# EAGLE schematic baseboard4 (EAGLE 4.15)

## Sheet 1 of 3
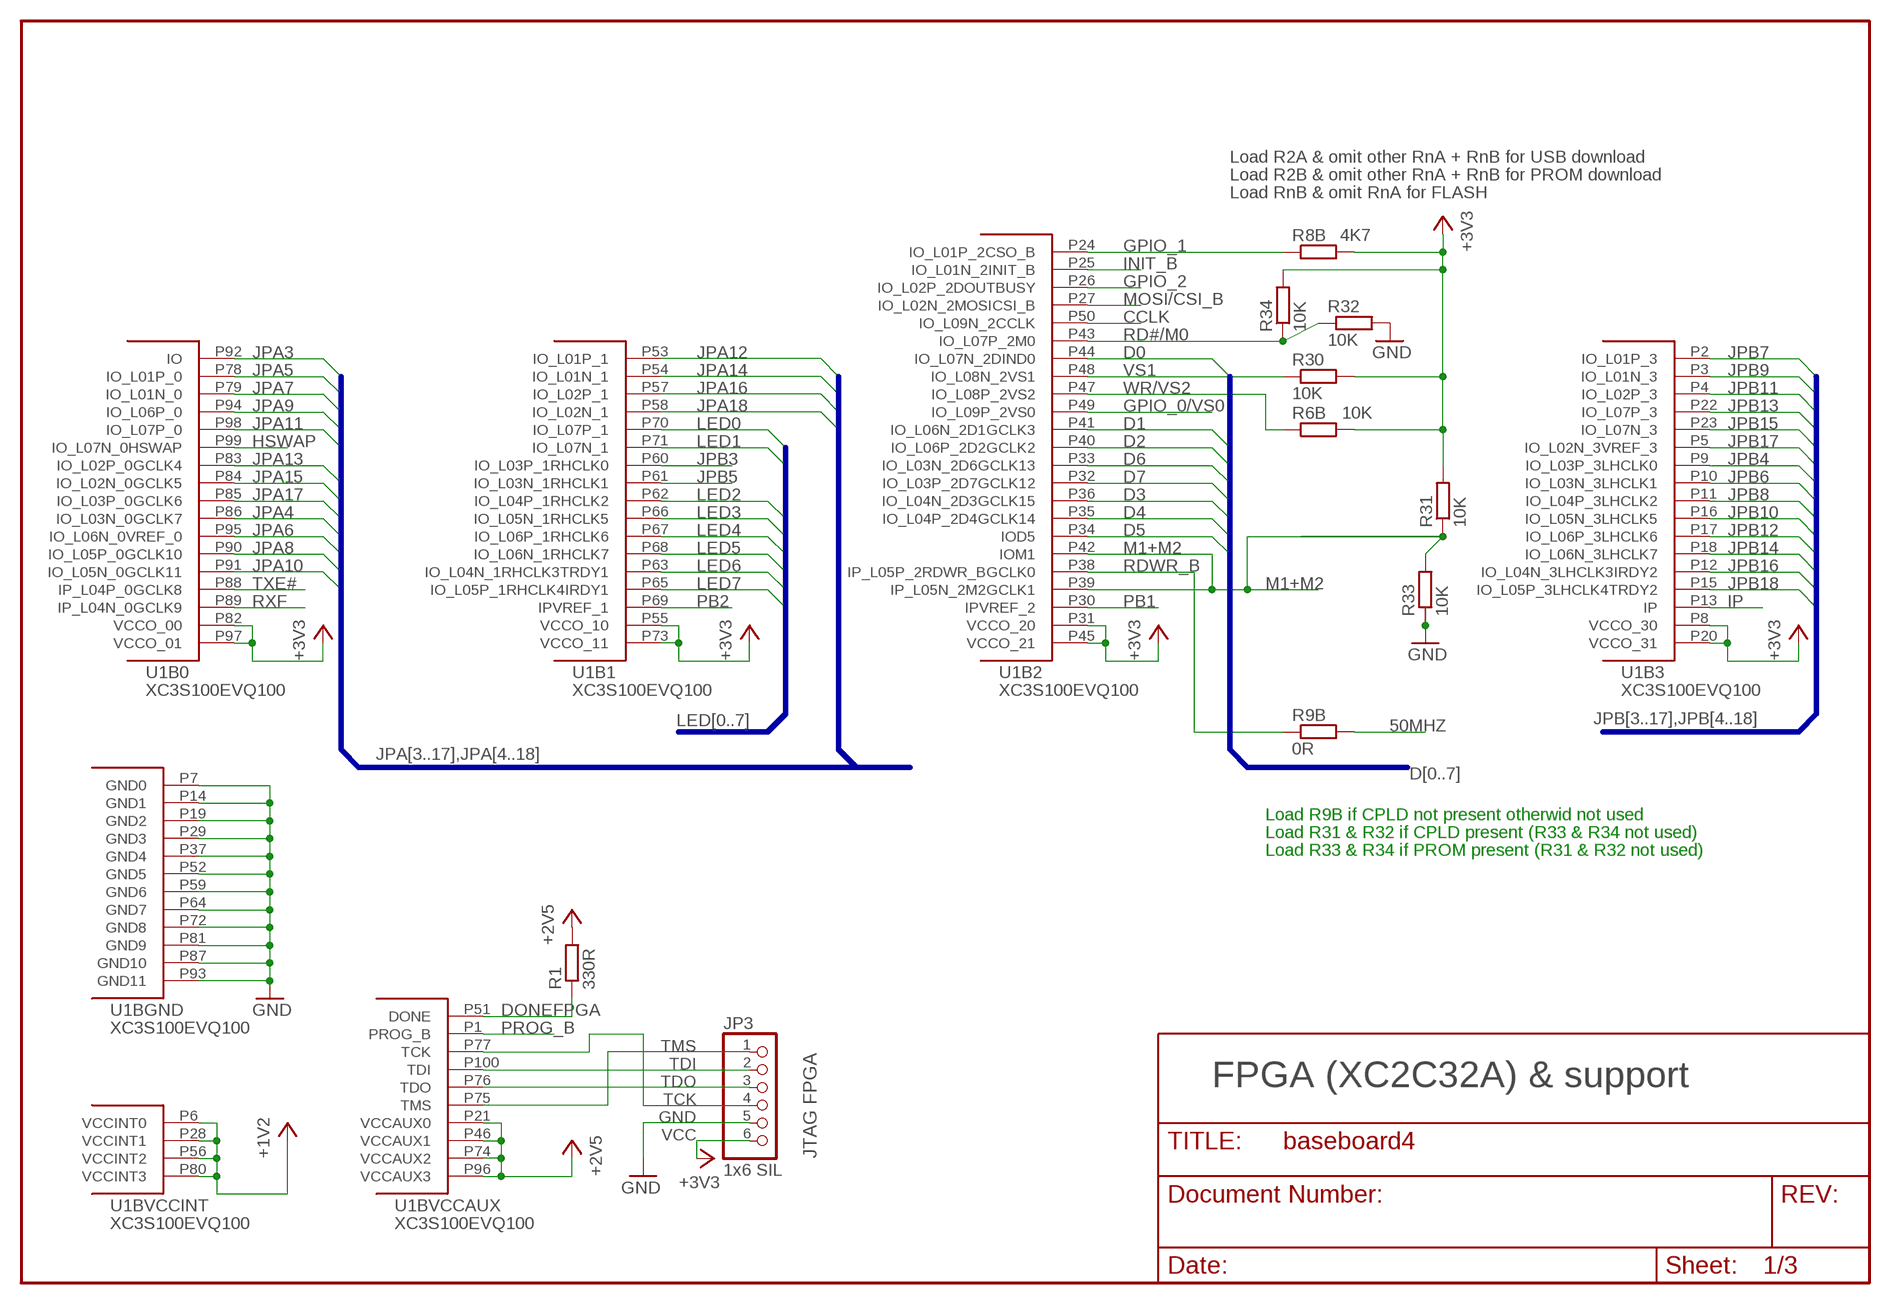
[diagram p0: schematic, sheet 1]

### Parts
JP3  1x6 SIL  PINHD-1X6  [1X06]
R1  330R  R-EU_R0603  [R0603]
R6B  10K  R-EU_R0603  [R0603]
R8B  4K7  R-EU_R0603  [R0603]
R9B  0R  R-EU_R0603  [R0603]
R30  10K  R-EU_R0603  [R0603]
R31  10K  R-EU_R0603  [R0603]
R32  10K  R-EU_R0603  [R0603]
R33  10K  R-EU_R0603  [R0603]
R34  10K  R-EU_R0603  [R0603]
U1  XC3S100EVQ100  [VQ100]

### Nets
50MHZ: R9B.2 ; also sheet 2
+1V2: U1.P6(BVCCINT:VCCINT0) U1.P28(BVCCINT:VCCINT1) U1.P56(BVCCINT:VCCINT2) U1.P80(BVCCINT:VCCINT3) ; also sheet 3
+2V5: R1.2 U1.P21(BVCCAUX:VCCAUX0) U1.P46(BVCCAUX:VCCAUX1) U1.P74(BVCCAUX:VCCAUX2) U1.P96(BVCCAUX:VCCAUX3) ; also sheet 3
+3V3: JP3.6 R6B.2 R8B.2 R30.2 R31.2 R34.2 U1.P8(B3:VCCO_30) U1.P20(B3:VCCO_31) U1.P31(B2:VCCO_20) U1.P45(B2:VCCO_21) U1.P55(B1:VCCO_10) U1.P73(B1:VCCO_11) U1.P82(B0:VCCO_00) U1.P97(B0:VCCO_01) ; also sheet 2,3
CCLK: U1.P50(B2:IO_L09N_2CCLK) ; also sheet 2
D0: U1.P44(B2:IO_L07N_2DIND0) ; also sheet 2
D1: U1.P41(B2:IO_L06N_2D1GCLK3) ; also sheet 2
D2: U1.P40(B2:IO_L06P_2D2GCLK2) ; also sheet 2
D3: U1.P36(B2:IO_L04N_2D3GCLK15) ; also sheet 2
D4: U1.P35(B2:IO_L04P_2D4GCLK14) ; also sheet 2
D5: U1.P34(B2:IOD5) ; also sheet 2
D6: U1.P33(B2:IO_L03N_2D6GCLK13) ; also sheet 2
D7: U1.P32(B2:IO_L03P_2D7GCLK12) ; also sheet 2
DONEFPGA: R1.1 U1.P51(BVCCAUX:DONE) ; also sheet 2
GND: JP3.5 R32.2 R33.1 U1.P7(BGND:GND0) U1.P14(BGND:GND1) U1.P19(BGND:GND2) U1.P29(BGND:GND3) U1.P37(BGND:GND4) U1.P52(BGND:GND5) U1.P59(BGND:GND6) U1.P64(BGND:GND7) U1.P72(BGND:GND8) U1.P81(BGND:GND9) U1.P87(BGND:GND10) U1.P93(BGND:GND11) ; also sheet 2,3
GPIO_0/VS0: U1.P49(B2:IO_L09P_2VS0) ; also sheet 2,3
GPIO_1: R8B.1 U1.P24(B2:IO_L01P_2CSO_B) ; also sheet 2,3
GPIO_2: U1.P26(B2:IO_L02P_2DOUTBUSY) ; also sheet 3
HSWAP: U1.P99(B0:IO_L07N_0HSWAP) ; also sheet 2
INIT_B: U1.P25(B2:IO_L01N_2INIT_B) ; also sheet 2
IP: U1.P13(B3:IP) ; also sheet 2,3
JPA3: U1.P92(B0:IO) ; also sheet 3
JPA4: U1.P86(B0:IO_L03N_0GCLK7) ; also sheet 3
JPA5: U1.P78(B0:IO_L01P_0) ; also sheet 3
JPA6: U1.P95(B0:IO_L06N_0VREF_0) ; also sheet 3
JPA7: U1.P79(B0:IO_L01N_0) ; also sheet 3
JPA8: U1.P90(B0:IO_L05P_0GCLK10) ; also sheet 3
JPA9: U1.P94(B0:IO_L06P_0) ; also sheet 3
JPA10: U1.P91(B0:IO_L05N_0GCLK11) ; also sheet 3
JPA11: U1.P98(B0:IO_L07P_0) ; also sheet 3
JPA12: U1.P53(B1:IO_L01P_1) ; also sheet 3
JPA13: U1.P83(B0:IO_L02P_0GCLK4) ; also sheet 3
JPA14: U1.P54(B1:IO_L01N_1) ; also sheet 3
JPA15: U1.P84(B0:IO_L02N_0GCLK5) ; also sheet 3
JPA16: U1.P57(B1:IO_L02P_1) ; also sheet 3
JPA17: U1.P85(B0:IO_L03P_0GCLK6) ; also sheet 3
JPA18: U1.P58(B1:IO_L02N_1) ; also sheet 3
JPB3: U1.P60(B1:IO_L03P_1RHCLK0) ; also sheet 3
JPB4: U1.P9(B3:IO_L03P_3LHCLK0) ; also sheet 3
JPB5: U1.P61(B1:IO_L03N_1RHCLK1) ; also sheet 3
JPB6: U1.P10(B3:IO_L03N_3LHCLK1) ; also sheet 3
JPB7: U1.P2(B3:IO_L01P_3) ; also sheet 3
JPB8: U1.P11(B3:IO_L04P_3LHCLK2) ; also sheet 3
JPB9: U1.P3(B3:IO_L01N_3) ; also sheet 3
JPB10: U1.P16(B3:IO_L05N_3LHCLK5) ; also sheet 3
JPB11: U1.P4(B3:IO_L02P_3) ; also sheet 3
JPB12: U1.P17(B3:IO_L06P_3LHCLK6) ; also sheet 3
JPB13: U1.P22(B3:IO_L07P_3) ; also sheet 3
JPB14: U1.P18(B3:IO_L06N_3LHCLK7) ; also sheet 3
JPB15: U1.P23(B3:IO_L07N_3) ; also sheet 3
JPB16: U1.P12(B3:IO_L04N_3LHCLK3IRDY2) ; also sheet 3
JPB17: U1.P5(B3:IO_L02N_3VREF_3) ; also sheet 3
JPB18: U1.P15(B3:IO_L05P_3LHCLK4TRDY2) ; also sheet 3
LED0: U1.P70(B1:IO_L07P_1) ; also sheet 3
LED1: U1.P71(B1:IO_L07N_1) ; also sheet 3
LED2: U1.P62(B1:IO_L04P_1RHCLK2) ; also sheet 3
LED3: U1.P66(B1:IO_L05N_1RHCLK5) ; also sheet 3
LED4: U1.P67(B1:IO_L06P_1RHCLK6) ; also sheet 3
LED5: U1.P68(B1:IO_L06N_1RHCLK7) ; also sheet 3
LED6: U1.P63(B1:IO_L04N_1RHCLK3TRDY1) ; also sheet 3
LED7: U1.P65(B1:IO_L05P_1RHCLK4IRDY1) ; also sheet 3
M1+M2: R31.1 R33.2 U1.P39(B2:IP_L05N_2M2GCLK1) U1.P42(B2:IOM1) ; also sheet 2
MOSI/CSI_B: U1.P27(B2:IO_L02N_2MOSICSI_B) ; also sheet 2
N$3: R30.1 U1.P48(B2:IO_L08N_2VS1)
PB1: U1.P30(B2:IPVREF_2) ; also sheet 3
PB2: U1.P69(B1:IPVREF_1) ; also sheet 3
PROG_B: U1.P1(BVCCAUX:PROG_B) ; also sheet 2,3
RD#/M0: R32.1 R34.1 U1.P43(B2:IO_L07P_2M0) ; also sheet 2
RDWR_B: R9B.1 U1.P38(B2:IP_L05P_2RDWR_BGCLK0) ; also sheet 2
RXF: U1.P89(B0:IP_L04N_0GCLK9) ; also sheet 2
TCK_FPGA: JP3.4 U1.P77(BVCCAUX:TCK)
TDI_FPGA: JP3.2 U1.P100(BVCCAUX:TDI)
TDO_FPGA: JP3.3 U1.P76(BVCCAUX:TDO)
TMS_FPGA: JP3.1 U1.P75(BVCCAUX:TMS)
TXE#: U1.P88(B0:IP_L04P_0GCLK8) ; also sheet 2
WR/VS2: R6B.1 U1.P47(B2:IO_L08P_2VS2) ; also sheet 2

### Buses
JPA[3..17],JPA[4..18]
JPB[3..17],JPB[4..18]
D[0..7]
LED[0..7]

### Notes on the sheet
- Load R2A & omit other RnA + RnB for USB download
- Load R2B & omit other RnA + RnB for PROM download
- Load RnB & omit RnA for FLASH
- JPA3 | JPA12
- VS1
- JPA18
- JPA11
- JPA13 | JPB3
- JPB5
- JPA4
- JPA10
- Load R9B if CPLD not present otherwid not used
- Load R31 & R32 if CPLD present (R33 & R34 not used)
- Load R33 & R34 if PROM present (R31 & R32 not used)
- TMS
- TDI
- TDO | FPGA (XC2C32A) & support
- TCK
- GND
- VCC
- JTAG FPGA

## Sheet 2 of 3
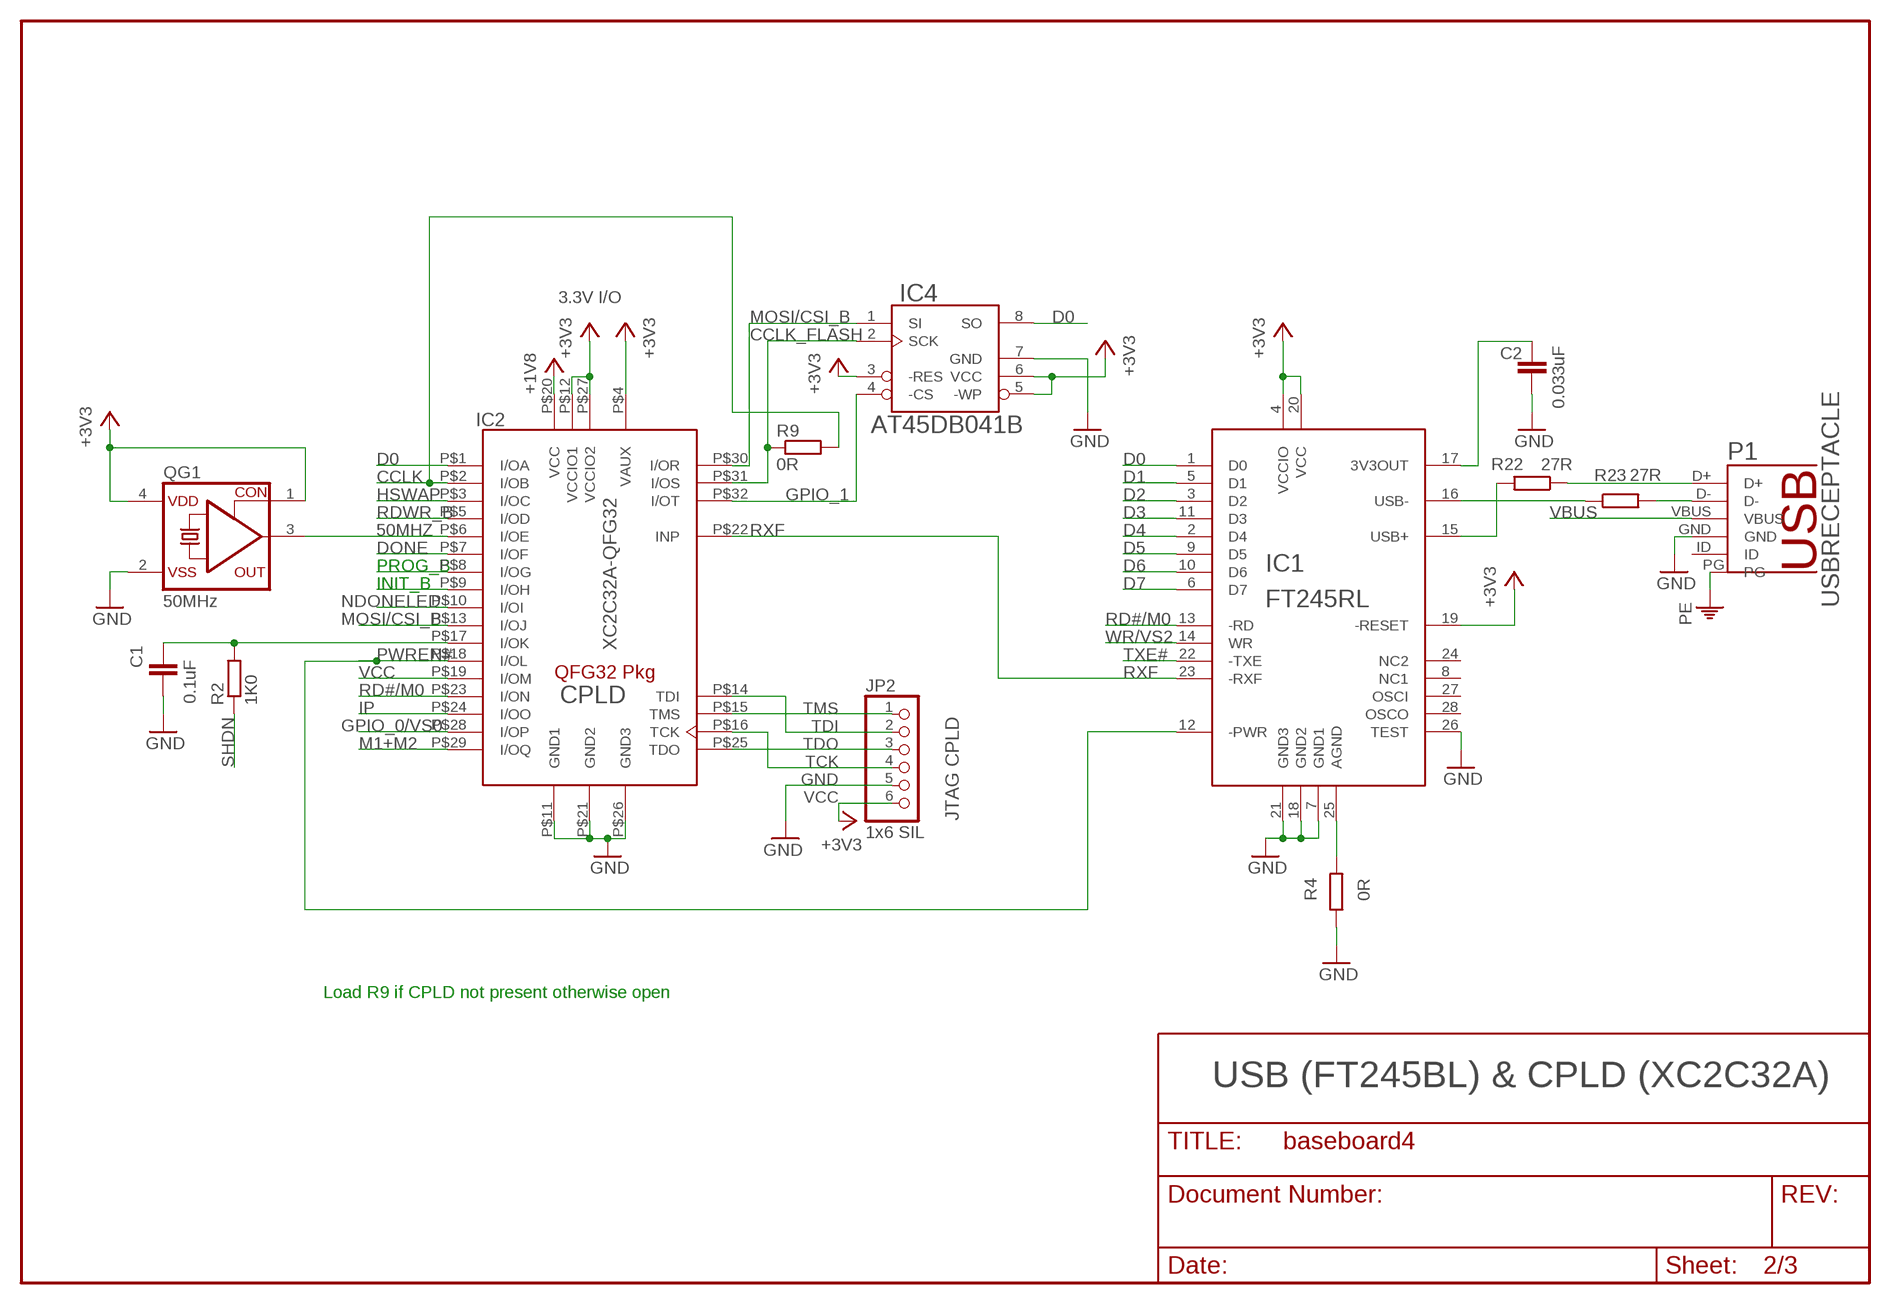
[diagram p1: schematic, sheet 2]

### Parts
C1  0.1uF  C-EUC0603  [C0603]
C2  0.033uF  C-EUC0603  [C0603]
IC1  FT245RLSSOP-28  [SSOP28C]
IC2  XC2C32A-QFG32MOD_QFN32  [QFN32-ALT]
IC4  AT45DB041D-SU  AT45DB041BSOIC  [SO-08M]
JP2  1x6 SIL  PINHD-1X6  [1X06]
P1  USBRECEPTACLE  [MOLEXUSBRECEPT.0675031020]
QG1  50MHz  CRYSTAL_RES-FOX-HC73  [HC73]
R2  1K0  R-EU_R0603  [R0603]
R4  0R  R-EU_R0603  [R0603]
R9  0R  R-EU_R0603  [R0603]
R22  27R  R-EU_R0603  [R0603]
R23  27R  R-EU_R0603  [R0603]

### Nets
50MHZ: IC2.P$6(I/OE) QG1.3(OUT) ; also sheet 1
+1V8: IC2.P$20(VCC) ; also sheet 3
+3V3: IC1.4(VCCIO) IC1.19(-RESET) IC1.20(VCC) IC2.P$4(VAUX) IC2.P$12(VCCIO1) IC2.P$27(VCCIO2) IC4.3(-RES) IC4.5(-WP) IC4.6(VCC) JP2.6 QG1.1(CON) QG1.4(VDD) ; also sheet 1,3
AGND: IC1.25(AGND) R4.2
CCLK: IC2.P$2(I/OB) R9.2 ; also sheet 1
CCLK_FLASH: IC2.P$31(I/OS) IC4.2(SCK) R9.1
D0: IC1.1(D0) IC2.P$1(I/OA) IC4.8(SO) ; also sheet 1
D1: IC1.5(D1) ; also sheet 1
D2: IC1.3(D2) ; also sheet 1
D3: IC1.11(D3) ; also sheet 1
D4: IC1.2(D4) ; also sheet 1
D5: IC1.9(D5) ; also sheet 1
D6: IC1.10(D6) ; also sheet 1
D7: IC1.6(D7) ; also sheet 1
DONEFPGA: IC2.P$7(I/OF) ; also sheet 1
GND: C1.2 C2.2 IC1.7(GND1) IC1.18(GND2) IC1.21(GND3) IC1.26(TEST) IC2.P$11(GND1) IC2.P$21(GND2) IC2.P$26(GND3) IC4.7(GND) JP2.5 P1.GND QG1.2(VSS) R4.1 ; also sheet 1,3
GPIO_0/VS0: IC2.P$28(I/OP) ; also sheet 1,3
GPIO_1: IC2.P$32(I/OT) IC4.4(-CS) ; also sheet 1,3
HSWAP: IC2.P$3(I/OC) ; also sheet 1
INIT_B: IC2.P$9(I/OH) ; also sheet 1
IP: IC2.P$24(I/OO) ; also sheet 1,3
M1+M2: IC2.P$29(I/OQ) ; also sheet 1
MOSI/CSI_B: IC2.P$13(I/OJ) IC2.P$30(I/OR) IC4.1(SI) ; also sheet 1
N$5: P1.D+ R22.1
N$8: P1.D- R23.2
N$18: C2.1 IC1.17(3V3OUT)
N$20: IC1.16(USB-) R23.1
N$26: C1.1 IC2.P$17(I/OK) R2.2
NDONELED: IC2.P$10(I/OI) ; also sheet 3
PE: P1.PG
PROG_B: IC2.P$8(I/OG) ; also sheet 1,3
PWREN#: IC1.12(-PWR) IC2.P$18(I/OL)
RD#/M0: IC1.13(-RD) IC2.P$23(I/ON) ; also sheet 1
RDWR_B: IC2.P$5(I/OD) ; also sheet 1
RXF: IC1.23(-RXF) IC2.P$22(INP) ; also sheet 1
SHDN: R2.1 ; also sheet 3
TCK: IC2.P$16(TCK) JP2.4
TDI: IC2.P$14(TDI) JP2.2
TDO: IC2.P$25(TDO) JP2.3
TMS: IC2.P$15(TMS) JP2.1
TXE#: IC1.22(-TXE) ; also sheet 1
USB+: IC1.15(USB+) R22.2
VBUS: P1.VBUS ; also sheet 3
VCC: IC2.P$19(I/OM) ; also sheet 3
WR/VS2: IC1.14(WR) ; also sheet 1
Unconnected: IC1.8(NC1) IC1.24(NC2) IC1.27(OSCI) IC1.28(OSCO) P1.ID

### Notes on the sheet
- 3.3V I/O
- D0 | D0
- CCLK | D1
- HSWAP | D2
- D3
- 50MHZ | D4
- DONE | D5
- PROG_B | D6
- INIT_B
- RXF
- CPLD
- TMS
- TDI
- TDO
- TCK
- GND
- VCC
- JTAG CPLD
- Load R9 if CPLD not present otherwise open
- USB (FT245BL) & CPLD (XC2C32A)

## Sheet 3 of 3
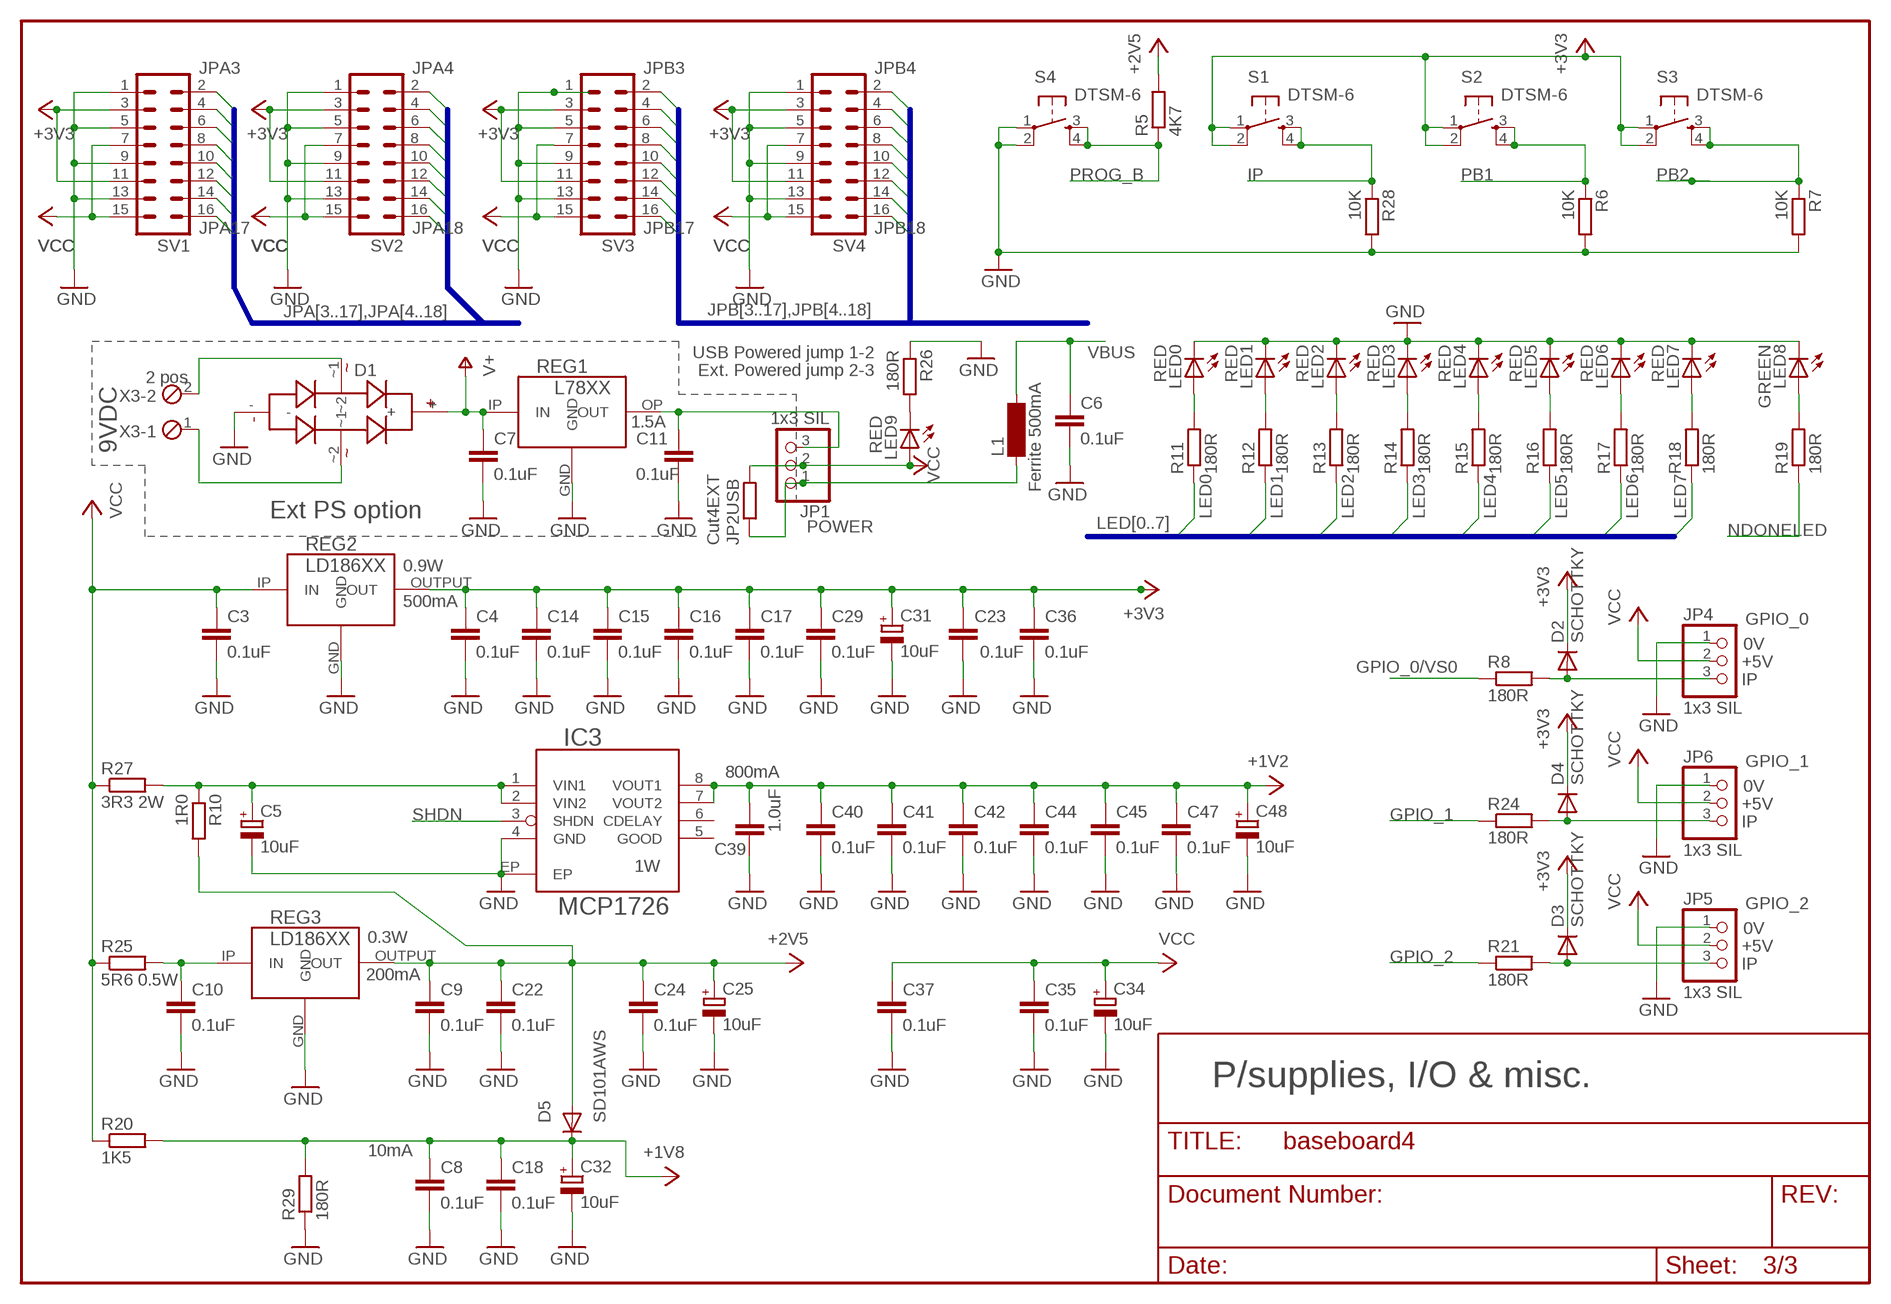
[diagram p2: schematic, sheet 3]

### Parts
C3  0.1uF  C-EUC0603  [C0603]
C4  0.1uF  C-EUC0603  [C0603]
C5  10uF  CPOL-EUA  [PANASONIC_A]
C6  0.1uF  C-EUC0603  [C0603]
C7  0.1uF  C-EUC0603  [C0603]
C8  0.1uF  C-EUC0603  [C0603]
C9  0.1uF  C-EUC0603  [C0603]
C10  0.1uF  C-EUC0603  [C0603]
C11  0.1uF  C-EUC0603  [C0603]
C14  0.1uF  C-EUC0603  [C0603]
C15  0.1uF  C-EUC0603  [C0603]
C16  0.1uF  C-EUC0603  [C0603]
C17  0.1uF  C-EUC0603  [C0603]
C18  0.1uF  C-EUC0603  [C0603]
C22  0.1uF  C-EUC0603  [C0603]
C23  0.1uF  C-EUC0603  [C0603]
C24  0.1uF  C-EUC0603  [C0603]
C25  10uF  CPOL-EUA  [PANASONIC_A]
C29  0.1uF  C-EUC0603  [C0603]
C31  10uF  CPOL-EUA  [PANASONIC_A]
C32  10uF  CPOL-EUA  [PANASONIC_A]
C34  10uF  CPOL-EUA  [PANASONIC_A]
C35  0.1uF  C-EUC0603  [C0603]
C36  0.1uF  C-EUC0603  [C0603]
C37  0.1uF  C-EUC0603  [C0603]
C39  1.0uF  C-EUC0603  [C0603]
C40  0.1uF  C-EUC0603  [C0603]
C41  0.1uF  C-EUC0603  [C0603]
C42  0.1uF  C-EUC0603  [C0603]
C44  0.1uF  C-EUC0603  [C0603]
C45  0.1uF  C-EUC0603  [C0603]
C47  0.1uF  C-EUC0603  [C0603]
C48  10uF  CPOL-EUA  [PANASONIC_A]
D1  L7805CD2T-TR  DIODE_BRIDGE_DFSDFS  [DFS]
D2  SCHOTTKY  DIODE-SOD323-W  [SOD323-W]
D3  SCHOTTKY  DIODE-SOD323-W  [SOD323-W]
D4  SCHOTTKY  DIODE-SOD323-W  [SOD323-W]
D5  SD101AWS  DIODE-SOD323-W  [SOD323-W]
IC3  MCP1726  MCP1726_FIXED  [DFN-8B]
JP1  1x3 SIL  PINHD-1X3  [1X03]
JP2USB  Cut4EXT  R-EU_R0603  [R0603]
JP4  1x3 SIL  PINHD-1X3  [1X03]
JP5  1x3 SIL  PINHD-1X3  [1X03]
JP6  1x3 SIL  PINHD-1X3  [1X03]
L1  Ferrite 500mA  SM-NE29  [SM-NE29]
LED0  RED  LEDCHIPLED_0603  [CHIPLED_0603]
LED1  RED  LEDCHIPLED_0603  [CHIPLED_0603]
LED2  RED  LEDCHIPLED_0603  [CHIPLED_0603]
LED3  RED  LEDCHIPLED_0603  [CHIPLED_0603]
LED4  RED  LEDCHIPLED_0603  [CHIPLED_0603]
LED5  RED  LEDCHIPLED_0603  [CHIPLED_0603]
LED6  RED  LEDCHIPLED_0603  [CHIPLED_0603]
LED7  RED  LEDCHIPLED_0603  [CHIPLED_0603]
LED8  GREEN  LEDCHIPLED_0603  [CHIPLED_0603]
LED9  RED  LEDCHIPLED_0603  [CHIPLED_0603]
R5  4K7  R-EU_R0603  [R0603]
R6  10K  R-EU_R0603  [R0603]
R7  10K  R-EU_R0603  [R0603]
R8  180R  R-EU_R0603  [R0603]
R10  1R0  R-EU_R1210W  [R1210W]
R11  180R  R-EU_R0603  [R0603]
R12  180R  R-EU_R0603  [R0603]
R13  180R  R-EU_R0603  [R0603]
R14  180R  R-EU_R0603  [R0603]
R15  180R  R-EU_R0603  [R0603]
R16  180R  R-EU_R0603  [R0603]
R17  180R  R-EU_R0603  [R0603]
R18  180R  R-EU_R0603  [R0603]
R19  180R  R-EU_R0603  [R0603]
R20  1K5  R-EU_R0603  [R0603]
R21  180R  R-EU_R0603  [R0603]
R24  180R  R-EU_R0603  [R0603]
R25  5R6 0.5W  R-EU_R1210  [R1210]
R26  180R  R-EU_R0603  [R0603]
R27  3R3 2W  R-EU_0817/22  [P0817/22]
R28  10K  R-EU_R0603  [R0603]
R29  180R  R-EU_R0603  [R0603]
REG1  L78XX_REGULATORL78XX  [D2PAKC]
REG2  LD1086XXD2PAKB  [D2PAKB]
REG3  LD1086XXD2PAKB  [D2PAKB]
S1  DTSM-6  [DTSM-6]
S2  DTSM-6  [DTSM-6]
S3  DTSM-6  [DTSM-6]
S4  DTSM-6  [DTSM-6]
SV1  ML16  [ML16]
SV2  ML16  [ML16]
SV3  ML16  [ML16]
SV4  ML16  [ML16]
X3  2 pos  MPT2  [2POL254]

### Nets
+1V2: C39.1 C40.1 C41.1 C42.1 C44.1 C45.1 C47.1 C48.+ IC3.7(VOUT2) IC3.8(VOUT1) ; also sheet 1
+1V8: C8.1 C18.1 C32.+ D5.C R20.2 R29.2 ; also sheet 2
+2V5: C9.1 C22.1 C24.1 C25.+ D5.A R5.2 R10.2 REG3.OUTPUT(OUT) ; also sheet 1
+3V3: C4.1 C14.1 C15.1 C16.1 C17.1 C23.2 C29.1 C31.+ C36.1 D2.C D3.C D4.C REG2.OUTPUT(OUT) S1.1 S1.2 S2.1 S2.2 S3.1 S3.2 SV1.3 SV1.11 SV2.3 SV2.11 SV3.3 SV3.11 SV4.3 SV4.11 ; also sheet 1,2
+5V_EXT: C11.1 JP1.3 REG1.OP(OUT)
+5V_USB: JP1.1 JP2USB.1 L1.1
GND: C3.2 C4.2 C5.- C6.2 C7.2 C8.2 C9.2 C10.2 C11.2 C14.2 C15.2 C16.2 C17.2 C18.2 C22.2 C23.1 C24.2 C25.- C29.2 C31.- C32.- C34.- C35.2 C36.2 C37.2 C39.2 C40.2 C41.2 C42.2 C44.2 C45.2 C47.2 C48.- D1.- IC3.4(GND) IC3.EP JP4.1 JP5.1 JP6.1 LED0.C LED1.C LED2.C LED3.C LED4.C LED5.C LED6.C LED7.C LED8.C R6.2 R7.2 R26.1 R28.2 R29.1 REG1.GND REG2.GND REG3.GND S4.1 S4.2 SV1.1 SV1.5 SV1.9 SV1.13 SV2.1 SV2.5 SV2.9 SV2.13 SV3.1 SV3.5 SV3.9 SV3.13 SV4.1 SV4.5 SV4.9 SV4.13 ; also sheet 1,2
GPIO_0/VS0: R8.1 ; also sheet 1,2
GPIO_1: R24.1 ; also sheet 1,2
GPIO_2: R21.1 ; also sheet 1
IP: R28.1 S1.3 S1.4 ; also sheet 1,2
JPA3: SV1.2 ; also sheet 1
JPA4: SV2.2 ; also sheet 1
JPA5: SV1.4 ; also sheet 1
JPA6: SV2.4 ; also sheet 1
JPA7: SV1.6 ; also sheet 1
JPA8: SV2.6 ; also sheet 1
JPA9: SV1.8 ; also sheet 1
JPA10: SV2.8 ; also sheet 1
JPA11: SV1.10 ; also sheet 1
JPA12: SV2.10 ; also sheet 1
JPA13: SV1.12 ; also sheet 1
JPA14: SV2.12 ; also sheet 1
JPA15: SV1.14 ; also sheet 1
JPA16: SV2.14 ; also sheet 1
JPA17: SV1.16 ; also sheet 1
JPA18: SV2.16 ; also sheet 1
JPB3: SV3.2 ; also sheet 1
JPB4: SV4.2 ; also sheet 1
JPB5: SV3.4 ; also sheet 1
JPB6: SV4.4 ; also sheet 1
JPB7: SV3.6 ; also sheet 1
JPB8: SV4.6 ; also sheet 1
JPB9: SV3.8 ; also sheet 1
JPB10: SV4.8 ; also sheet 1
JPB11: SV3.10 ; also sheet 1
JPB12: SV4.10 ; also sheet 1
JPB13: SV3.12 ; also sheet 1
JPB14: SV4.12 ; also sheet 1
JPB15: SV3.14 ; also sheet 1
JPB16: SV4.14 ; also sheet 1
JPB17: SV3.16 ; also sheet 1
JPB18: SV4.16 ; also sheet 1
LED0: R11.1 ; also sheet 1
LED1: R12.1 ; also sheet 1
LED2: R13.1 ; also sheet 1
LED3: R14.1 ; also sheet 1
LED4: R15.1 ; also sheet 1
LED5: R16.1 ; also sheet 1
LED6: R17.1 ; also sheet 1
LED7: R18.1 ; also sheet 1
N$1: LED0.A R11.2
N$2: LED1.A R12.2
N$4: LED9.C R26.2
N$9: LED2.A R13.2
N$10: LED3.A R14.2
N$11: LED4.A R15.2
N$12: LED5.A R16.2
N$13: LED6.A R17.2
N$14: LED7.A R18.2
N$15: LED8.A R19.2
N$17: C5.+ IC3.1(VIN1) IC3.2(VIN2) R10.1 R27.2
N$19: D3.A JP5.3 R21.2
N$22: C10.1 R25.2 REG3.IP(IN)
N$24: D1.~1 X3.2
N$25: D1.~2 X3.1
N$27: D2.A JP4.3 R8.2
N$28: D4.A JP6.3 R24.2
NDONELED: R19.1 ; also sheet 2
PB1: R6.1 S2.3 S2.4 ; also sheet 1
PB2: R7.1 S3.3 S3.4 ; also sheet 1
PROG_B: R5.1 S4.3 S4.4 ; also sheet 1,2
SHDN: IC3.3(SHDN) ; also sheet 2
V+: C7.1 D1.+ REG1.IP(IN)
VBUS: C6.1 L1.2 ; also sheet 2
VCC: C3.1 C34.+ C35.1 C37.1 JP1.2 JP2USB.2 JP4.2 JP5.2 JP6.2 LED9.A R20.1 R25.1 R27.1 REG2.IP(IN) SV1.7 SV1.15 SV2.7 SV2.15 SV3.7 SV3.15 SV4.7 SV4.15 ; also sheet 2
Unconnected: IC3.5(GOOD) IC3.6(CDELAY)

### Buses
JPA[3..17],JPA[4..18]
JPB[3..17],JPB[4..18]
LED[0..7]

### Notes on the sheet
- JPA3 | JPA4 | JPB3 | JPB4
- JPA17 | JPA18 | JPB18
- USB Powered jump 1-2
- D1 | Ext. Powered jump 2-3
- 1.5A
- 9VDC
- Ext PS option
- POWER
- 0.9W
- 500mA
- GPIO_0
- 0V
- +5V
- IP
- GPIO_1
- 800mA
- 0V
- +5V
- IP
- 1W
- GPIO_2
- 0V
- 0.3W
- +5V
- IP
- 200mA
- P/supplies, I/O & misc.
- 10mA

## Library data of the parts
C1-C4 C6-C11 C14-C18 C22-C24 C29 C35-C37 C39-C42 C44 C45 C47 = rcl:C-EU: CAPACITOR, European symbol
C5 C25 C31 C32 C34 C48 = rcl:CPOL-EU: POLARIZED CAPACITOR, European symbol
D1 = Ken:DIODE_BRIDGE_DFS: Full wave diode bridge
D2-D5 = diode:DIODE-: DIODE
IC1 = Ken:FT245RL: USB Controller. 28p ssop
IC2 = Ken:XC2C32A-QFG32
IC3 = Ken:MCP1726_FIXED: MCP1726 Fixed Voltage Regulator. NF or MO-229 pkg.
IC4 = Ken:AT45DB041B: 4Mb SPI Flash
JP1 JP4-JP6 = pinhead2:PINHD-1X3: PIN HEADER
JP2 JP3 = pinhead:PINHD-1X6: PIN HEADER
JP2USB R1 R2 R4-R6 R6B R7 R8 R8B R9 R9B R10-R34 = rcl:R-EU_: RESISTOR, European symbol
L1 = inductor-neosid:SM-NE29: INDUCTOR SMD chip inductor
LED0 LED1-LED9 = led:LED: LED OSRAM: - CHIPLED LG R971, LG N971, LY N971, LG Q971, LY Q971, LO R971, LY R971 LH N974, LH R974 LS Q976, LO Q976, LY Q976 LO Q996 - Hyper CHIPLED LW Q18S LB Q993, LB Q99A, LB R99A - SideLED LS A670, LO A670, LY A670, LG A670, LP A670 LB A673, LV A673, LT A673, LW A673 LH A674 LY A675 LS A676, LA A676, LO A676, LY A676, LW A676 LS A679, LY A679, LG A679 - Hyper Micro SIDELED® LS Y876, LA Y876, LO Y876, LY Y876 LT Y87S - SmartLED LW L88C, LW L88S LB L89C, LB L89S, LG L890 LS L89K, LO L89K, LY L89K LS L896, LA L896, LO L896, LY L896 - TOPLED LS T670, LO T670, LY T670, LG T670, LP T670 LSG T670, LSP T670, LSY T670, LOP T670, LYG T670 LG T671, LOG T671, LSG T671 LB T673, LV T673, LT T673, LW T673 LH T674 LS T676, LA T676, LO T676, LY T676, LB T676, LH T676, LSB T676, LW T676 LB T67C, LV T67C, LT T67C, LS T67K, LO T67K, LY T67K, LW E67C LS E67B, LA E67B, LO E67B, LY E67B, LB E67C, LV E67C, LT E67C LW T67C LS T679, LY T679, LG T679 LS T770, LO T770, LY T770, LG T770, LP T770 LB T773, LV T773, LT T773, LW T773 LH T774 LS E675, LA E675, LY E675, LS T675 LS T776, LA T776, LO T776, LY T776, LB T776 LHGB T686 LT T68C, LB T68C - Hyper Mini TOPLED® LB M676 - Mini TOPLED Santana® LG M470 LS M47K, LO M47K, LY M47K Source: http://www.osram.convergy.de/
P1 = Ken:USBRECEPTACLE: Molex USB receptacle p/n 0675031020
QG1 = crystal:CRYSTAL_RES-: CRYSTAL RESONATOR
REG1 = Ken:L78XX_REGULATOR: Positive Fixed Voltage Regulator
REG2 REG3 = Ken:LD1086XX: Corrected pad dimension for D2PAK Fixed Vltage Regulator
S1-S4 = switch-tact:DTSM-6
SV1-SV4 = con-harting-ml:ML16: HARTING
U1 = xilinx_spartan3_virtex4_and_5:XC3S100EVQ100: Xilinx FPGA
X3 = con-phoenix-254:MPT2: PHOENIX CONNECTOR